# Altium schematic sheet IO.SchDoc
size A3; SheetNumber: 6; SheetTotal: 7
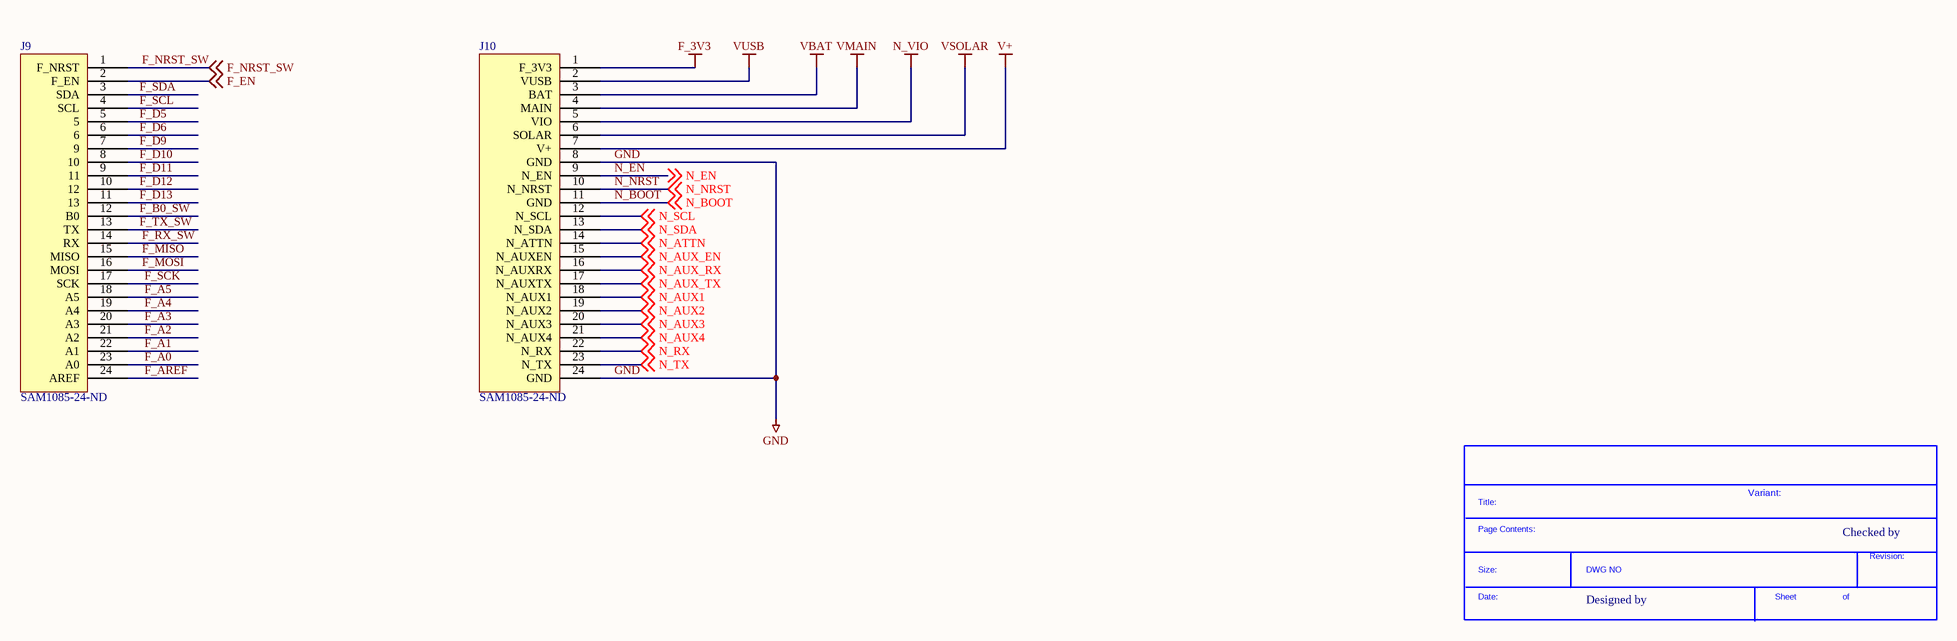
[diagram p0: IO.SchDoc]

## Parts
*?  SDTitleBlock  (value not drawn)  (graphical)
J9  Supplier Part Number 1: SAM1085-24-ND  [CES-124-01-S-S]  (hidden comment: 24x1)
J10  Supplier Part Number 1: SAM1085-24-ND  [CES-124-01-S-S]  (hidden comment: 24X1)

## Nets
F_3V3: J10.1(F_3V3)
GND: J10.8(GND) J10.24(GND)
N_VIO: J10.5(VIO)
V+: J10.7(V+)
VBAT: J10.3(BAT)
VMAIN: J10.4(MAIN)
VSOLAR: J10.6(SOLAR)
VUSB: J10.2(VUSB)
F_A0: J9.23(A0)
F_A1: J9.22(A1)
F_A2: J9.21(A2)
F_A3: J9.20(A3)
F_A4: J9.19(A4)
F_A5: J9.18(A5)
F_AREF: J9.24(AREF)
F_B0_SW: J9.12(B0)
F_D5: J9.5
F_D6: J9.6
F_D9: J9.7(9)
F_D10: J9.8(10)
F_D11: J9.9(11)
F_D12: J9.10(12)
F_D13: J9.11(13)
F_EN: J9.2(F_EN) ; off-sheet F_EN
F_MISO: J9.15(MISO)
F_MOSI: J9.16(MOSI)
F_NRST_SW: J9.1(F_NRST) ; off-sheet F_NRST_SW
F_RX_SW: J9.14(RX)
F_SCK: J9.17(SCK)
F_SCL: J9.4(SCL)
F_SDA: J9.3(SDA)
F_TX_SW: J9.13(TX)
N_ATTN: J10.14(N_ATTN) ; off-sheet N_ATTN
N_AUX1: J10.18(N_AUX1) ; off-sheet N_AUX1
N_AUX2: J10.19(N_AUX2) ; off-sheet N_AUX2
N_AUX3: J10.20(N_AUX3) ; off-sheet N_AUX3
N_AUX4: J10.21(N_AUX4) ; off-sheet N_AUX4
N_AUX_EN: J10.15(N_AUXEN) ; off-sheet N_AUX_EN
N_AUX_RX: J10.16(N_AUXRX) ; off-sheet N_AUX_RX
N_AUX_TX: J10.17(N_AUXTX) ; off-sheet N_AUX_TX
N_BOOT: J10.11(GND) ; off-sheet N_BOOT
N_EN: J10.9(N_EN) ; off-sheet N_EN
N_NRST: J10.10(N_NRST) ; off-sheet N_NRST
N_RX: J10.22(N_RX) ; off-sheet N_RX
N_SCL: J10.12(N_SCL) ; off-sheet N_SCL
N_SDA: J10.13(N_SDA) ; off-sheet N_SDA
N_TX: J10.23(N_TX) ; off-sheet N_TX

## Notes on the sheet
- Variant:
- Checked by
- Designed by
- (in symbol SDTitleBlock) Title:; Page Contents:; Revision:; Size:; DWG NO; Date:; Sheet; of

## Library data of the parts
J9 = SIDECON: 24x1 0.1" pitch half height female header; PN: DNM; Supplier 1: Digi-Key
J10 = SIDECON_N: 24x1 0.1" pitch half height female header; PN: DNM; Supplier 1: Digi-Key